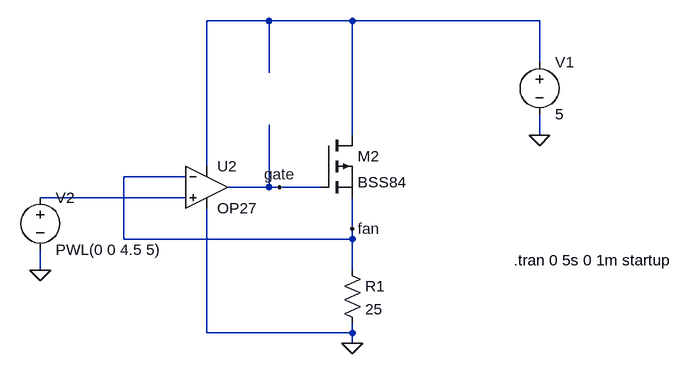
[diagram p0: schematic toilet4me2-fan.asc]
toilet4me2-fan.asc, the LTspice schematic file:
Version 4
SHEET 1 880 680
WIRE 240 -240 144 -240
WIRE 368 -240 240 -240
WIRE 656 -240 368 -240
WIRE 656 -176 656 -240
WIRE 240 -160 240 -240
WIRE 368 -64 368 -240
WIRE 656 -64 656 -96
WIRE 144 -16 144 -240
WIRE 112 0 16 0
WIRE 240 16 240 -80
WIRE 240 16 176 16
WIRE 256 16 240 16
WIRE 320 16 256 16
WIRE 112 32 -112 32
WIRE 368 80 368 32
WIRE 16 96 16 0
WIRE 368 96 368 80
WIRE 368 96 16 96
WIRE -112 144 -112 112
WIRE 368 144 368 96
WIRE 144 240 144 48
WIRE 368 240 368 224
WIRE 368 240 144 240
WIRE 368 256 368 240
FLAG 368 256 0
FLAG 656 -64 0
FLAG -112 144 0
FLAG 368 80 fan
FLAG 256 16 gate
SYMBOL res 352 128 R0
SYMATTR InstName R1
SYMATTR Value 25
SYMBOL voltage 656 -192 R0
WINDOW 123 0 0 Left 0
WINDOW 39 0 0 Left 0
SYMATTR InstName V1
SYMATTR Value 5
SYMBOL voltage -112 16 R0
WINDOW 123 0 0 Left 0
WINDOW 39 0 0 Left 0
SYMATTR InstName V2
SYMATTR Value PWL(0 0 4.5 5)
SYMBOL pmos 320 -64 R0
SYMATTR InstName M2
SYMATTR Value BSS84
SYMBOL Opamps\\OP27 144 -48 R0
SYMATTR InstName U2
TEXT 616 128 Left 2 !.tran 0 5s 0 1m startup

The netlist it stands for:
* toilet4me2-fan.asc
R1 fan 0 25
V1 N001 0 5
V2 N002 0 PWL(0 0 4.5 5)
M2 N001 gate fan fan BSS84
XU2 N002 fan N001 0 gate OP27  ; pins In+ In- V+ V- OUT
.model NMOS NMOS
.model PMOS PMOS
.lib standard.mos
.tran 0 5s 0 1m startup
.lib ADI.lib
.backanno
.end

* Results of the author's LTspice run, read from the files saved beside the schematic
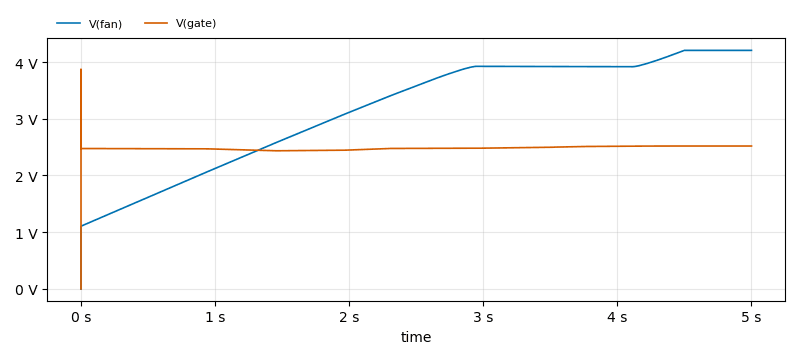
[diagram p1: Transient Analysis of toilet4me2-fan.asc, plotted from the saved traces]
* Transient Analysis, 1 run:
*   V(fan): min 0 V, max 4.209 V, average 3.169 V, rms 3.317 V, last 4.209 V
*   V(gate): min 0 V, max 3.877 V, average 2.483 V, rms 2.483 V, last 2.52 V